# EAGLE schematic main_schematics (EAGLE 9.5.2)
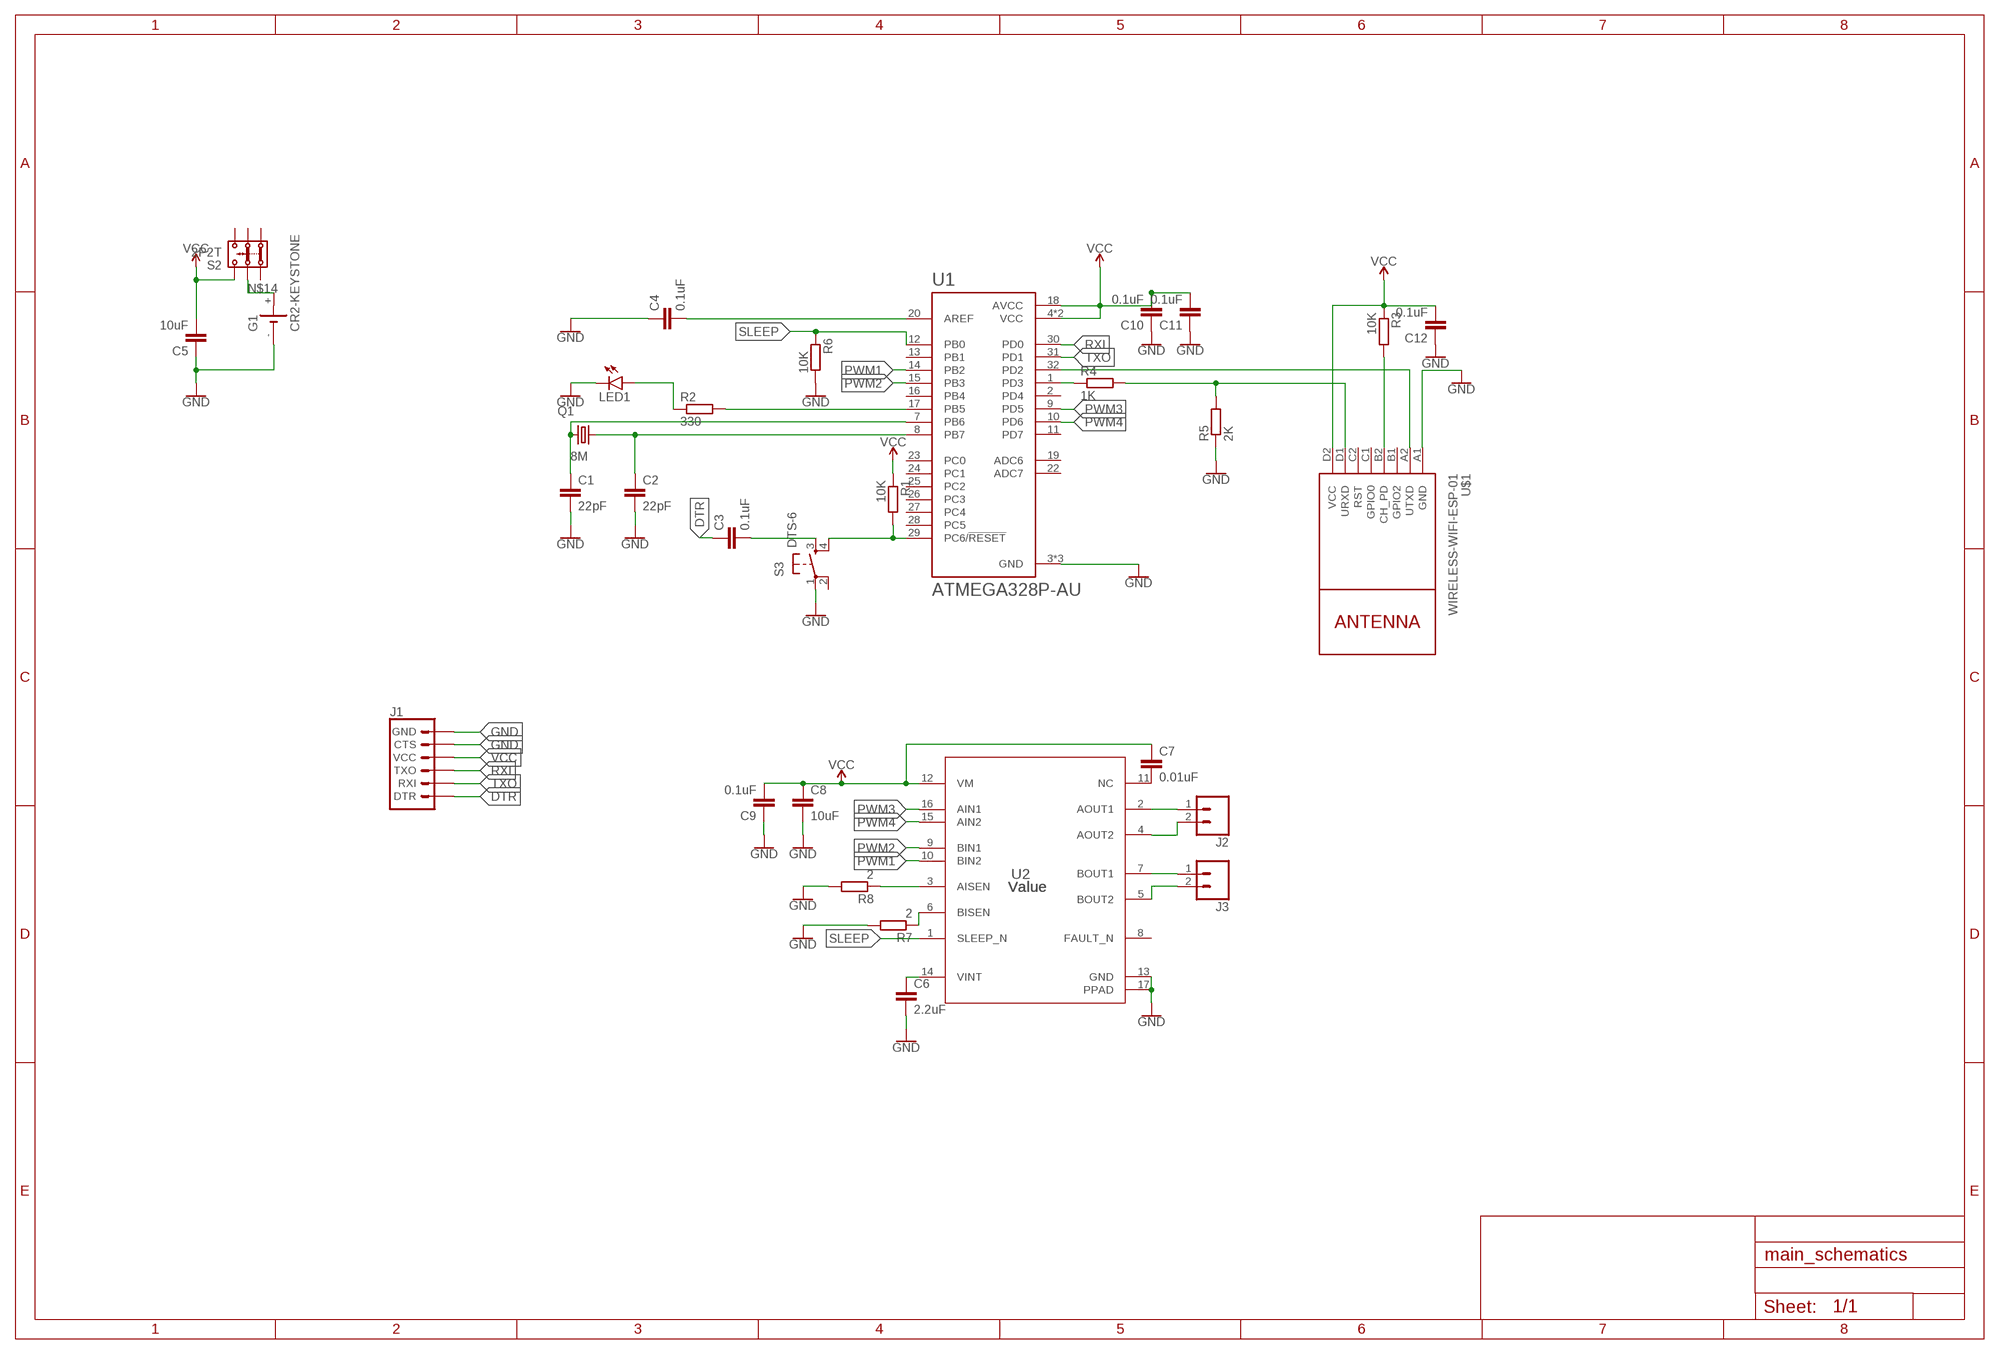
[diagram p0: schematic, sheet 1]

## Parts
C1  22pF  C-EUC0603  [C0603]
C2  22pF  C-EUC0603  [C0603]
C3  0.1uF  C-EUC0603  [C0603]
C4  0.1uF  C-EUC0603  [C0603]
C5  10uF  C-EUC0603  [C0603]
C6  2.2uF  C-EUC0603  [C0603]
C7  0.01uF  C-EUC0603  [C0603]
C8  10uF  C-EUC0603  [C0603]
C9  0.1uF  C-EUC0603  [C0603]
C10  0.1uF  C-EUC0603  [C0603]
C11  0.1uF  C-EUC0603  [C0603]
C12  0.1uF  C-EUC0603  [C0603]
G1  CR2-KEYSTONE  [SL-150-1/2AA/PR]
J1  6_PIN_SERIAL_TARGETLONGPADS  [1X06_LONGPADS]
J2  CONN_02POLAR  [MOLEX-1X2]
J3  CONN_02POLAR  [MOLEX-1X2]
LED1  LEDCHIP-LED0805  [CHIP-LED0805]
Q1  8M  CSM-7X-DU  [CSM-7X-DU]
R1  10K  R-EU_R0603  [R0603]
R2  330  R-EU_R0603  [R0603]
R3  10K  R-EU_R0603  [R0603]
R4  1K  R-EU_R0603  [R0603]
R5  2K  R-EU_R0603  [R0603]
R6  10K  R-EU_R0603  [R0603]
R7  2  R-EU_R0603  [R0603]
R8  2  R-EU_R0603  [R0603]
S2  2P2T  [2P2T]
S3  DTS-6  [DTS-6]
U1  ATMEGA328P-AU  [QFP80P900X900X120-32N]
U2  Value  DRV8833CPWPPWP0016K_M  [PWP0016K_M]
U$1  WIRELESS-WIFI-ESP-01  [WIRELESS-WIFI-ESP-01]

## Nets
DTR: C3.1 J1.1(DTR)
GND [GND]: C1.2 C2.2 C4.1 C5.1 C6.2 C8.2 C9.1 C10.1 C11.1 C12.1 G1.- J1.5(CTS) J1.6(GND) LED1.C R5.1 R6.2 R7.2 R8.2 S3.1 U1.3(GND) U1.5(GND) U1.21(GND) U2.13(GND) U2.17(PPAD) U$1.A1(GND)
N$1: C2.1 Q1.2 U1.8(PB7)
N$2: C1.1 Q1.1 U1.7(PB6)
N$3: C3.2 S3.3
N$4: R1.2 S3.4 U1.29(PC6/!RESET)
N$5: R3.2 U$1.B2(CH_PD)
N$6: R2.2 U1.17(PB5)
N$7: LED1.A R2.1
N$8: C4.2 U1.20(AREF)
N$9: U1.32(PD2) U$1.A2(UTXD)
N$10: R4.1 U1.1(PD3)
N$11: R4.2 R5.2 U$1.D1(URXD)
N$12: C6.1 U2.14(VINT)
N$13: C7.2 U2.11(NC)
N$14 [GND]: G1.+ S2.2.1
N$16: R7.1 U2.6(BISEN)
N$17: R8.1 U2.3(AISEN)
N$19: J2.1 U2.2(AOUT1)
N$20: J3.1 U2.7(BOUT1)
N$21: J2.2 U2.4(AOUT2)
N$22: J3.2 U2.5(BOUT2)
PWM1: U1.14(PB2) U2.10(BIN2)
PWM2: U1.15(PB3) U2.9(BIN1)
PWM3: U1.9(PD5) U2.16(AIN1)
PWM4: U1.10(PD6) U2.15(AIN2)
RXI: J1.3(TXO) U1.30(PD0)
SLEEP: R6.1 U1.12(PB0) U2.1(SLEEP_N)
TXO: J1.2(RXI) U1.31(PD1)
VCC [GND]: C5.2 C7.1 C8.1 C9.2 C10.2 C11.2 C12.2 J1.4(VCC) R1.1 R3.1 S2.3.1 U1.4(VCC) U1.6(VCC) U1.18(AVCC) U2.12(VM) U$1.D2(VCC)
Unconnected: S2.1.1 S2.1.2 S2.2.2 S2.3.2 S3.2 U1.2(PD4) U1.11(PD7) U1.13(PB1) U1.16(PB4) U1.19(ADC6) U1.22(ADC7) U1.23(PC0) U1.24(PC1) U1.25(PC2) U1.26(PC3) U1.27(PC4) U1.28(PC5) U2.8(FAULT_N) U$1.B1(GPIO2) U$1.C1(GPIO0) U$1.C2(RST)

## Library data of the parts
C1-C12 = rcl:C-EU: CAPACITOR, European symbol; SPICEPREFIX: C
G1 = battery:CR2-KEYSTONE: keystone battery holder cr2 1011
J1 = SparkFun-Connectors:6_PIN_SERIAL_TARGET: 6-pin header connection for use with the "FTDI BASIC" pinout - TARGET SIDE. Also known as "Arduino Serial Program Header". It is used to mate with our FTDI Basic serial programmers using the Arduino IDE. Note, this device has "TARGET" in the name. It is intended to be used on a design that contains a target micro-controller that you wish to program. The "sister" device, named "CABLE" is inteneded to be used on a design that usually lives on the end of your USB cable and prvides the converter chip (FTDI232 or FTDI231x) to commnicate serial RX/TX. You can populate with some of these: Break Away Headers - Straight <https://www.sparkfun.com/products/116> (PRT-00116) For reference (or to suit your programming needs) check out these designs: SparkFun FTDI Basic Breakout - 5V <https://www.sparkfun.com/products/9716> (DEV-09716) SparkFun FTDI Basic Breakout - 3.3V <https://www.sparkfun.com/products/9873> (DEV-09873) SparkFun FTDI SmartBasic <https://www.sparkfun.com/products/12935> (DEV-12935) SparkFun Beefy 3 - FTDI Basic Breakout <https://www.sparkfun.com/products/13746> (DEV-13746)
J2 J3 = SparkFun-Connectors:CONN_02: Multi connection point. Often used as Generic Header-pin footprint for 0.1 inch spaced/style header connections On any of the 0.1 inch spaced packages, you can populate with these: Break Away Headers - Straight <https://www.sparkfun.com/products/116> (PRT-00116) Break Away Male Headers - Right Angle <https://www.sparkfun.com/products/553> (PRT-00553) Female Headers <https://www.sparkfun.com/products/115> (PRT-00115) Break Away Headers - Machine Pin <https://www.sparkfun.com/products/117> (PRT-00117) Break Away Female Headers - Swiss Machine Pin <https://www.sparkfun.com/products/743> (PRT-00743) For SCREWTERMINALS and SPRING TERMINALS visit here: Screw Terimnals on SparkFun.com <https://www.sparkfun.com/search/results?term=Screw+Terminals> (5mm/3.5mm/2.54mm spacing) This device is also useful as a general connection point to wire up your design to another part of your project. Our various solder wires solder well into these plated through hole pads. Hook-Up Wire - Assortment (Stranded, 22 AWG) <https://www.sparkfun.com/products/11375> (PRT-11375) Hook-Up Wire - Assortment (Solid Core, 22 AWG) <https://www.sparkfun.com/products/11367> (PRT-11367) View the entire wire category on our website here <https://www.sparkfun.com/categories/141> Special notes: Molex polarized connector foot print use with: PRT-08233 with associated crimp pins and housings. 2.54_SCREWTERM for use with PRT-10571. 3.5mm Screw Terminal footprints for PRT-08084 5mm Screw Terminal footprints for use with PRT-08432; SF_ID: PRT-09918
LED1 = led:LED: LED OSRAM: - CHIPLED LG R971, LG N971, LY N971, LG Q971, LY Q971, LO R971, LY R971 LH N974, LH R974 LS Q976, LO Q976, LY Q976 LO Q996 - Hyper CHIPLED LW Q18S LB Q993, LB Q99A, LB R99A - SideLED LS A670, LO A670, LY A670, LG A670, LP A670 LB A673, LV A673, LT A673, LW A673 LH A674 LY A675 LS A676, LA A676, LO A676, LY A676, LW A676 LS A679, LY A679, LG A679 - Hyper Micro SIDELED® LS Y876, LA Y876, LO Y876, LY Y876 LT Y87S - SmartLED LW L88C, LW L88S LB L89C, LB L89S, LG L890 LS L89K, LO L89K, LY L89K LS L896, LA L896, LO L896, LY L896 - TOPLED LS T670, LO T670, LY T670, LG T670, LP T670 LSG T670, LSP T670, LSY T670, LOP T670, LYG T670 LG T671, LOG T671, LSG T671 LB T673, LV T673, LT T673, LW T673 LH T674 LS T676, LA T676, LO T676, LY T676, LB T676, LH T676, LSB T676, LW T676 LB T67C, LV T67C, LT T67C, LS T67K, LO T67K, LY T67K, LW E67C LS E67B, LA E67B, LO E67B, LY E67B, LB E67C, LV E67C, LT E67C LW T67C LS T679, LY T679, LG T679 LS T770, LO T770, LY T770, LG T770, LP T770 LB T773, LV T773, LT T773, LW T773 LH T774 LS E675, LA E675, LY E675, LS T675 LS T776, LA T776, LO T776, LY T776, LB T776 LHGB T686 LT T68C, LB T68C - Hyper Mini TOPLED® LB M676 - Mini TOPLED Santana® LG M470 LS M47K, LO M47K, LY M47K Source: http://www.osram.convergy.de LUXEON: - LUMILED® LXK2-PW12-R00, LXK2-PW12-S00, LXK2-PW14-U00, LXK2-PW14-V00 LXK2-PM12-R00, LXK2-PM12-S00, LXK2-PM14-U00 LXK2-PE12-Q00, LXK2-PE12-R00, LXK2-PE12-S00, LXK2-PE14-T00, LXK2-PE14-U00 LXK2-PB12-K00, LXK2-PB12-L00, LXK2-PB12-M00, LXK2-PB14-N00, LXK2-PB14-P00, LXK2-PB14-Q00 LXK2-PR12-L00, LXK2-PR12-M00, LXK2-PR14-Q00, LXK2-PR14-R00 LXK2-PD12-Q00, LXK2-PD12-R00, LXK2-PD12-S00 LXK2-PH12-R00, LXK2-PH12-S00 LXK2-PL12-P00, LXK2-PL12-Q00, LXK2-PL12-R00 Source: www.luxeon.com KINGBRIGHT: KA-3528ASYC Source: www.kingbright.com
Q1 = crystal:CSM-7X-DU: SMD CRYSTAL Source: www.ecsxtal.com .. Crystal 3.6864MHz CSM_7X_DU.PDF; OC_FARNELL: unknown; OC_NEWARK: unknown
R1-R8 = rcl:R-EU_: RESISTOR, European symbol; SPICEPREFIX: R
S2 = switch:2P2T: SLIDE SWITCH 2P2T Part No. SS-22F05-G(A)4 Source: CANAL ELECTRONIC CO., LTD .. switsch.pdf
S3 = switch-tact:DTS-6
U1 = ATMEGA328P-AU:ATMEGA328P-AU: ATmega Series 20 MHz 32 KB Flash 2 KB SRAM 8-Bit Microcontroller - TQFP-32; AVAILABILITY: Unavailable; DESCRIPTION: Microcontroller Mcu, 8 Bit, Atmega, 20mhz, Tqfp-32; MF: Microchip; MP: ATMEGA328P-AU; PACKAGE: TQFP-32 Microchip; PRICE: None
U2 = drv8833:DRV8833CPWP; MANUFACTURER: Texas Instruments; PARTNUMBER: DRV8833CPWPR; REFDES: RefDes; TYPE: TYPE
U$1 = diy-modules:WIRELESS-WIFI-ESP-01: Wireless Wi-Fi ESP-01 Module based on ESP8266 chip Click here to find device on ebay.com <http://www.ebay.com/sch/esp8266+esp+01+transceiver>

## Net classes
0 default: width 0.356 mm
1 GND: width 0.508 mm, clearance 0.076 mm to class 0